# Altium schematic sheet FPGA.SchDoc: FPGA Interface
size 431 x 254 mm; Engineer: Prasoon Sinha; DocumentNumber: 3; SheetNumber: 3; SheetTotal: 26
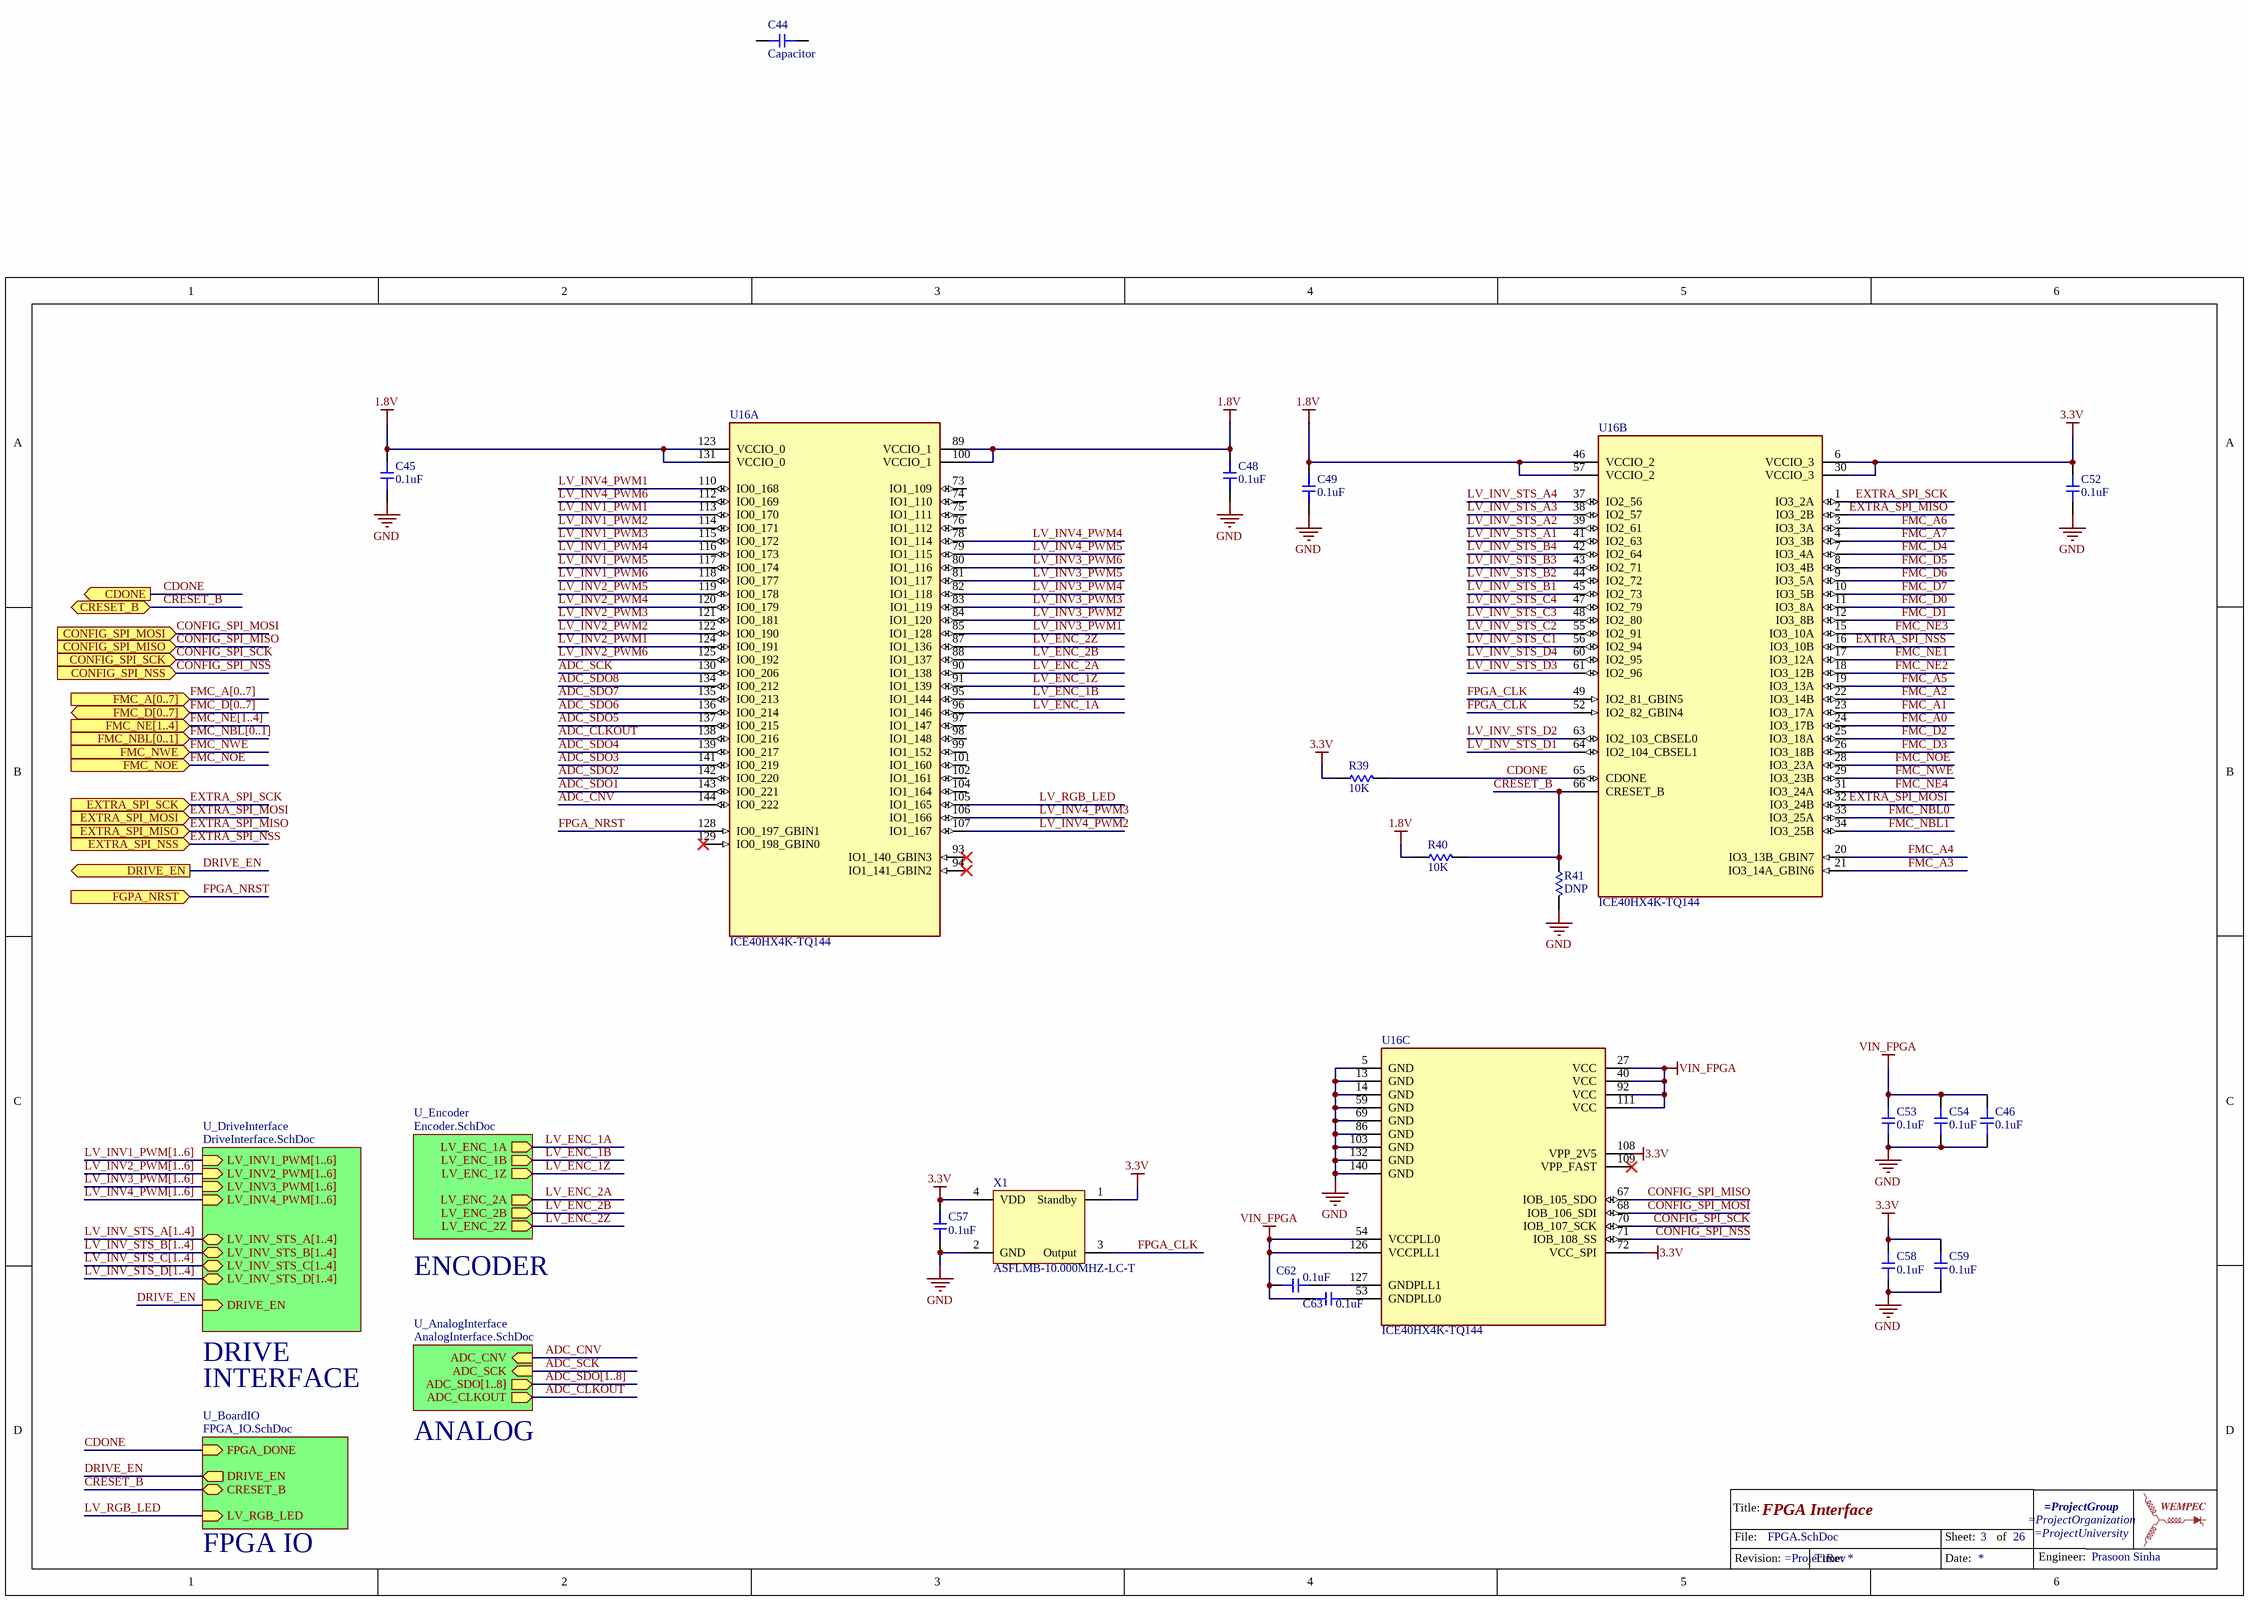
[diagram p0: FPGA.SchDoc]

## Parts
*?  TitleBlockWEMPEC  (value not drawn)  (graphical)
C44  Capacitor
C45  value 0.1uF  [0603-CAP]  (hidden comment: Capacitor)
C46  value 0.1uF  [0603-CAP]  (hidden comment: Capacitor)
C48  value 0.1uF  [0603-CAP]  (hidden comment: Capacitor)
C49  value 0.1uF  [0603-CAP]  (hidden comment: Capacitor)
C52  value 0.1uF  [0603-CAP]  (hidden comment: Capacitor)
C53  value 0.1uF  [0603-CAP]  (hidden comment: Capacitor)
C54  value 0.1uF  [0603-CAP]  (hidden comment: Capacitor)
C57  value 0.1uF  [0603-CAP]  (hidden comment: Capacitor)
C58  value 0.1uF  [0603-CAP]  (hidden comment: Capacitor)
C59  value 0.1uF  [0603-CAP]  (hidden comment: Capacitor)
C62  value 0.1uF  [0603-CAP]  (hidden comment: Capacitor)
C63  value 0.1uF  [0603-CAP]  (hidden comment: Capacitor)
R39  value 10K  [0603-RES]  (hidden comment: Resistor)
R40  value 10K  [0603-RES]  (hidden comment: Resistor)
R41  value DNP  [0603-RES]  (hidden comment: Resistor)
U16  ICE40HX4K-TQ144  [QFP50P2200X2200X160-144N]  (parts A,B,C of 3)
X1  ASFLMB-10.000MHZ-LC-T  [ASFLMB-50.000MHZ-LC-T]

## Sub-sheets
U_AnalogInterface = AnalogInterface.SchDoc: ADC_SDO[1..8] (out), ADC_CNV (in), ADC_SCK (in), ADC_CLKOUT (out)
U_BoardIO = FPGA_IO.SchDoc: FPGA_DONE (in), DRIVE_EN (out), LV_RGB_LED (in), CRESET_B (bidir)
U_DriveInterface = DriveInterface.SchDoc: LV_INV2_PWM[1..6] (in), LV_INV3_PWM[1..6] (in), LV_INV4_PWM[1..6] (in), LV_INV1_PWM[1..6] (in), DRIVE_EN (in), LV_INV_STS_A[1..4] (bidir), LV_INV_STS_D[1..4] (bidir), LV_INV_STS_C[1..4] (bidir), LV_INV_STS_B[1..4] (bidir)
U_Encoder = Encoder.SchDoc: LV_ENC_1A (out), LV_ENC_1B (out), LV_ENC_1Z (out), LV_ENC_2A (out), LV_ENC_2B (out), LV_ENC_2Z (out)

## Ports
CDONE (out), CONFIG_SPI_MISO (in), CONFIG_SPI_MOSI (in), CONFIG_SPI_NSS (in), CONFIG_SPI_SCK (in), CRESET_B (bidir), DRIVE_EN (out), EXTRA_SPI_MISO (in), EXTRA_SPI_MOSI (in), EXTRA_SPI_NSS (in), EXTRA_SPI_SCK (in), FGPA_NRST (in), FMC_A[0..7] (in), FMC_D[0..7] (bidir), FMC_NBL[0..1] (in), FMC_NE[1..4] (in), FMC_NOE (in), FMC_NWE (in)

## Nets
1.8V: C45.1 C48.1 C49.1 R40.1 U16.46(VCCIO_2) U16.57(VCCIO_2) U16.89(VCCIO_1) U16.100(VCCIO_1) U16.123(VCCIO_0) U16.131(VCCIO_0)
3.3V: C52.1 C57.1 C58.1 C59.1 R39.1 U16.6(VCCIO_3) U16.30(VCCIO_3) U16.72(VCC_SPI) X1.1(Standby) X1.4(VDD)
GND: C45.2 C46.2 C48.2 C49.2 C52.2 C53.2 C54.2 C57.2 C58.2 C59.2 R41.2 U16.5(GND) U16.13(GND) U16.14(GND) U16.59(GND) U16.69(GND) U16.86(GND) U16.103(GND) U16.132(GND) U16.140(GND) X1.2(GND)
VIN_FPGA: C46.1 C53.1 C54.1 C62.1 C63.1 U16.27(VCC) U16.40(VCC) U16.54(VCCPLL0) U16.92(VCC) U16.111(VCC) U16.126(VCCPLL1)
ADC_CLKOUT: U16.138(IO0_216) ; sheet U_AnalogInterface/ADC_CLKOUT
ADC_CNV: U16.144(IO0_222) ; sheet U_AnalogInterface/ADC_CNV
ADC_SCK: U16.130(IO0_206) ; sheet U_AnalogInterface/ADC_SCK
ADC_SDO1: U16.143(IO0_221)
ADC_SDO2: U16.142(IO0_220)
ADC_SDO3: U16.141(IO0_219)
ADC_SDO4: U16.139(IO0_217)
ADC_SDO5: U16.137(IO0_215)
ADC_SDO6: U16.136(IO0_214)
ADC_SDO7: U16.135(IO0_213)
ADC_SDO8: U16.134(IO0_212)
CDONE: R39.2 U16.65(CDONE) ; port CDONE, sheet U_BoardIO/FPGA_DONE
CONFIG_SPI_MISO: U16.67(IOB_105_SDO) ; port CONFIG_SPI_MISO
CONFIG_SPI_MOSI: U16.68(IOB_106_SDI) ; port CONFIG_SPI_MOSI
CONFIG_SPI_NSS: U16.71(IOB_108_SS) ; port CONFIG_SPI_NSS
CONFIG_SPI_SCK: U16.70(IOB_107_SCK) ; port CONFIG_SPI_SCK
CRESET_B: R40.2 R41.1 U16.66(CRESET_B) ; port CRESET_B, sheet U_BoardIO/CRESET_B
DRIVE_EN: port DRIVE_EN, sheet U_DriveInterface/DRIVE_EN, sheet U_BoardIO/DRIVE_EN
EXTRA_SPI_MISO: U16.2(IO3_2B) ; port EXTRA_SPI_MISO
EXTRA_SPI_MOSI: U16.32(IO3_24B) ; port EXTRA_SPI_MOSI
EXTRA_SPI_NSS: U16.16(IO3_10B) ; port EXTRA_SPI_NSS
EXTRA_SPI_SCK: U16.1(IO3_2A) ; port EXTRA_SPI_SCK
FMC_A0: U16.24(IO3_17B)
FMC_A1: U16.23(IO3_17A)
FMC_A2: U16.22(IO3_14B)
FMC_A3: U16.21(IO3_14A_GBIN6)
FMC_A4: U16.20(IO3_13B_GBIN7)
FMC_A5: U16.19(IO3_13A)
FMC_A6: U16.3(IO3_3A)
FMC_A7: U16.4(IO3_3B)
FMC_D0: U16.11(IO3_8A)
FMC_D1: U16.12(IO3_8B)
FMC_D2: U16.25(IO3_18A)
FMC_D3: U16.26(IO3_18B)
FMC_D4: U16.7(IO3_4A)
FMC_D5: U16.8(IO3_4B)
FMC_D6: U16.9(IO3_5A)
FMC_D7: U16.10(IO3_5B)
FMC_NBL0: U16.33(IO3_25A)
FMC_NBL1: U16.34(IO3_25B)
FMC_NE1: U16.17(IO3_12A)
FMC_NE2: U16.18(IO3_12B)
FMC_NE3: U16.15(IO3_10A)
FMC_NE4: U16.31(IO3_24A)
FMC_NOE: U16.28(IO3_23A) ; port FMC_NOE
FMC_NWE: U16.29(IO3_23B) ; port FMC_NWE
FPGA_CLK: U16.49(IO2_81_GBIN5) U16.52(IO2_82_GBIN4) X1.3(Output)
FPGA_NRST: U16.128(IO0_197_GBIN1) ; port FGPA_NRST
LV_ENC_1A: U16.96(IO1_146) ; sheet U_Encoder/LV_ENC_1A
LV_ENC_1B: U16.95(IO1_144) ; sheet U_Encoder/LV_ENC_1B
LV_ENC_1Z: U16.91(IO1_139) ; sheet U_Encoder/LV_ENC_1Z
LV_ENC_2A: U16.90(IO1_138) ; sheet U_Encoder/LV_ENC_2A
LV_ENC_2B: U16.88(IO1_137) ; sheet U_Encoder/LV_ENC_2B
LV_ENC_2Z: U16.87(IO1_136) ; sheet U_Encoder/LV_ENC_2Z
LV_INV1_PWM1: U16.113(IO0_170)
LV_INV1_PWM2: U16.114(IO0_171)
LV_INV1_PWM3: U16.115(IO0_172)
LV_INV1_PWM4: U16.116(IO0_173)
LV_INV1_PWM5: U16.117(IO0_174)
LV_INV1_PWM6: U16.118(IO0_177)
LV_INV2_PWM1: U16.124(IO0_191)
LV_INV2_PWM2: U16.122(IO0_190)
LV_INV2_PWM3: U16.121(IO0_181)
LV_INV2_PWM4: U16.120(IO0_179)
LV_INV2_PWM5: U16.119(IO0_178)
LV_INV2_PWM6: U16.125(IO0_192)
LV_INV3_PWM1: U16.85(IO1_128)
LV_INV3_PWM2: U16.84(IO1_120)
LV_INV3_PWM3: U16.83(IO1_119)
LV_INV3_PWM4: U16.82(IO1_118)
LV_INV3_PWM5: U16.81(IO1_117)
LV_INV3_PWM6: U16.80(IO1_116)
LV_INV4_PWM1: U16.110(IO0_168)
LV_INV4_PWM2: U16.107(IO1_167)
LV_INV4_PWM3: U16.106(IO1_166)
LV_INV4_PWM4: U16.78(IO1_114)
LV_INV4_PWM5: U16.79(IO1_115)
LV_INV4_PWM6: U16.112(IO0_169)
LV_INV_STS_A1: U16.41(IO2_63)
LV_INV_STS_A2: U16.39(IO2_61)
LV_INV_STS_A3: U16.38(IO2_57)
LV_INV_STS_A4: U16.37(IO2_56)
LV_INV_STS_B1: U16.45(IO2_73)
LV_INV_STS_B2: U16.44(IO2_72)
LV_INV_STS_B3: U16.43(IO2_71)
LV_INV_STS_B4: U16.42(IO2_64)
LV_INV_STS_C1: U16.56(IO2_94)
LV_INV_STS_C2: U16.55(IO2_91)
LV_INV_STS_C3: U16.48(IO2_80)
LV_INV_STS_C4: U16.47(IO2_79)
LV_INV_STS_D1: U16.64(IO2_104_CBSEL1)
LV_INV_STS_D2: U16.63(IO2_103_CBSEL0)
LV_INV_STS_D3: U16.61(IO2_96)
LV_INV_STS_D4: U16.60(IO2_95)
LV_RGB_LED: U16.105(IO1_165) ; sheet U_BoardIO/LV_RGB_LED
NetC62_2: C62.2 U16.127(GNDPLL1)
NetC63_2: C63.2 U16.53(GNDPLL0)

Not connected (* = marked no-connect by the designer): C44 1 2; U16 73(IO1_109) 74(IO1_110) 75(IO1_111) 76(IO1_112) 93(IO1_140_GBIN3)* 94(IO1_141_GBIN2)* 97(IO1_147) 98(IO1_148) 99(IO1_152) 101(IO1_160) 102(IO1_161) 104(IO1_164) 108(VPP_2V5) 109(VPP_FAST)* 129(IO0_198_GBIN0)*

## Buses and harness runs
bus ADC_SDO[1..8] = sheet U_AnalogInterface/ADC_SDO[1..8]
bus FMC_A[0..7] = port FMC_A[0..7]
bus FMC_D[0..7] = port FMC_D[0..7]
bus FMC_NBL[0..1] = port FMC_NBL[0..1]
bus FMC_NE[1..4] = port FMC_NE[1..4]
bus LV_INV1_PWM[1..6] = sheet U_DriveInterface/LV_INV1_PWM[1..6]
bus LV_INV2_PWM[1..6] = sheet U_DriveInterface/LV_INV2_PWM[1..6]
bus LV_INV3_PWM[1..6] = sheet U_DriveInterface/LV_INV3_PWM[1..6]
bus LV_INV4_PWM[1..6] = sheet U_DriveInterface/LV_INV4_PWM[1..6]
bus LV_INV_STS_A[1..4] = sheet U_DriveInterface/LV_INV_STS_A[1..4]
bus LV_INV_STS_B[1..4] = sheet U_DriveInterface/LV_INV_STS_B[1..4]
bus LV_INV_STS_C[1..4] = sheet U_DriveInterface/LV_INV_STS_C[1..4]
bus LV_INV_STS_D[1..4] = sheet U_DriveInterface/LV_INV_STS_D[1..4]

## Notes on the sheet
- ENCODER
- DRIVE
- INTERFACE
- ANALOG
- FPGA IO
- Labels drawn without touching a wire or pin: 3.3V
- (in symbol TitleBlockWEMPEC) Title:; File:; Sheet:; of; Engineer:; Revision:; Time:; Date:

## Library data of the parts
U16 = ICE40HX4K-TQ144: IC FPGA 107 I/O 144TQFP; Supplier Part Number 1: 220-1572-ND
X1 = ASFLMB-10.000MHZ-LC-T: 10MHz XO (Standard) LVCMOS Oscillator 1.8V ~ 3.3V Standby (Power Down) 4-SMD, No Lead; Supplier Part Number 1: 535-11762-1-ND
C44-C46 C48 C49 C52-C54 C57-C59 C62 C63 = Capacitor
  C45 C46 C48 C49 C52-C54 C57-C59 C62 C63: Supplier 1: Digi-Key; Supplier Part Number 1: 1276-1012-1-ND
R39-R41 = Resistor: Supplier 1: Digi-Key
  R39 R40: Supplier Part Number 1: 541-5136-1-ND
  R41: Supplier Part Number 1: 311-470LDCT-ND